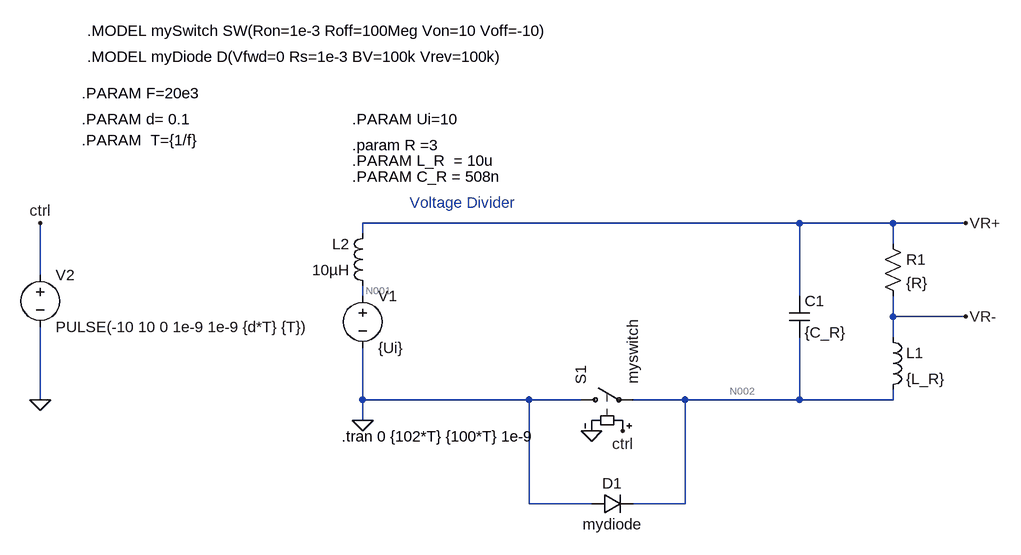
[diagram p0: schematic RLC_excited.asc]
RLC_excited.asc, the LTspice schematic file:
Version 4
SHEET 1 1032 680
WIRE 704 112 32 112
WIRE 848 112 704 112
WIRE 960 112 848 112
WIRE 32 128 32 112
WIRE 848 144 848 112
WIRE -464 192 -464 112
WIRE 32 224 32 208
WIRE 704 224 704 112
WIRE 848 256 848 224
WIRE 960 256 848 256
WIRE 848 288 848 256
WIRE -464 384 -464 272
WIRE 32 384 32 304
WIRE 288 384 32 384
WIRE 368 384 288 384
WIRE 528 384 448 384
WIRE 704 384 704 288
WIRE 704 384 528 384
WIRE 848 384 848 368
WIRE 848 384 704 384
WIRE 32 416 32 384
WIRE 288 544 288 384
WIRE 384 544 288 544
WIRE 528 544 528 384
WIRE 528 544 448 544
FLAG 32 416 0
FLAG 960 256 VR-
FLAG 384 432 0
FLAG 432 432 ctrl
FLAG -464 384 0
FLAG -464 112 ctrl
FLAG 960 112 VR+
SYMBOL res 832 128 R0
SYMATTR InstName R1
SYMATTR Value {R}
SYMBOL voltage 32 208 R0
WINDOW 123 0 0 Left 0
WINDOW 39 0 0 Left 0
SYMATTR InstName V1
SYMATTR Value {Ui}
SYMBOL ind 832 272 R0
SYMATTR InstName L1
SYMATTR Value {L_R}
SYMBOL sw 352 384 R270
SYMATTR InstName S1
SYMATTR Value myswitch
SYMBOL voltage -464 176 R0
WINDOW 123 0 0 Left 0
WINDOW 39 0 0 Left 0
SYMATTR InstName V2
SYMATTR Value PULSE(-10 10 0 1e-9 1e-9 {d*T} {T})
SYMBOL diode 384 560 R270
WINDOW 0 32 32 VTop 2
WINDOW 3 0 32 VBottom 2
SYMATTR InstName D1
SYMATTR Value mydiode
SYMBOL ind 48 224 R180
WINDOW 0 36 80 Left 2
WINDOW 3 36 40 Left 2
SYMATTR InstName L2
SYMATTR Value 10µH
SYMBOL cap 688 224 R0
SYMATTR InstName C1
SYMATTR Value {C_R}
TEXT 0 440 Left 2 !.tran 0 {102*T} {100*T} 1e-9
TEXT 104 80 Left 2 ;Voltage Divider
TEXT 16 -48 Left 2 !.PARAM Ui=10
TEXT 16 -8 Left 2 !.param R =3
TEXT -400 -88 Left 2 !.PARAM F=20e3
TEXT -400 -48 Left 2 !.PARAM d= 0.1
TEXT -400 -16 Left 2 !.PARAM  T={1/f}
TEXT -392 -184 Left 2 !.MODEL mySwitch SW(Ron=1e-3 Roff=100Meg Von=10 Voff=-10)
TEXT -392 -144 Left 2 !.MODEL myDiode D(Vfwd=0 Rs=1e-3 BV=100k Vrev=100k)
TEXT 16 16 Left 2 !.PARAM L_R  = 10u
TEXT 16 40 Left 2 !.PARAM C_R = 508n

The netlist it stands for:
* RLC_excited.asc
R1 VR+ VR- {R}
V1 N001 0 {Ui}
L1 VR- N002 {L_R}
S1 0 N002 ctrl 0 myswitch
V2 ctrl 0 PULSE(-10 10 0 1e-9 1e-9 {d*T} {T})
D1 0 N002 mydiode
L2 N001 VR+ 10µH
C1 VR+ N002 {C_R}
.model D D
.lib standard.dio
.tran 0 {102*T} {100*T} 1e-9
* Voltage Divider
.PARAM Ui=10
.param R =3
.PARAM F=20e3
.PARAM d= 0.1
.PARAM  T={1/f}
.MODEL mySwitch SW(Ron=1e-3 Roff=100Meg Von=10 Voff=-10)
.MODEL myDiode D(Vfwd=0 Rs=1e-3 BV=100k Vrev=100k)
.PARAM L_R  = 10u
.PARAM C_R = 508n
.backanno
.end

* Results of the author's LTspice run, read from the files saved beside the schematic
* Operating Point, zero values left out:
*   V(vr+) = 10 V
*   V(vr-) = 10 V
*   V(n001) = 10 V
*   V(n002) = 10 V
*   V(ctrl) = -10 V
*   I(D1) = -10.01 pA
*   I(L1) = 100 nA
*   I(L2) = 100 nA
*   I(R1) = 100 nA
*   I(S1) = 100 nA
*   I(V1) = -100 nA
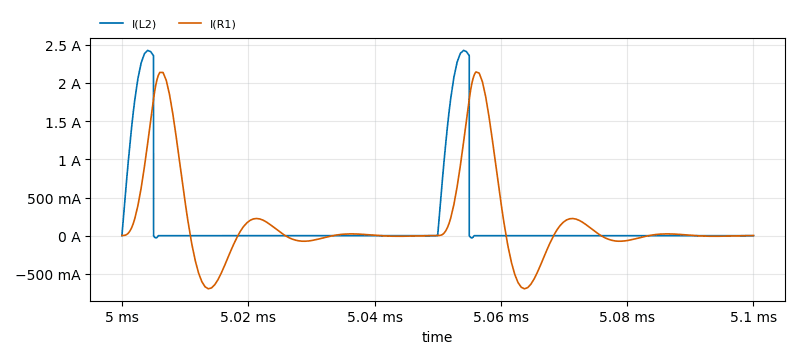
[diagram p1: Transient Analysis of RLC_excited.asc, plotted from the saved traces]
* Transient Analysis, 1 run:
*   I(L2): min -28.93 mA, max 2.427 A, average 172.8 mA, rms 595.5 mA, last 0 A
*   I(R1): min -695.6 mA, max 2.144 A, average 173.2 mA, rms 625.9 mA, last 1.936 mA